# Altium schematic sheet PCB_Schematic.SchDoc: PCB-Schematik
size A4; Date: 22.11.2025; Author: Alexander Schiechtl; Revision: v1.0; SheetNumber: 1; SheetTotal: 1; Project: 3D_Scanner; SPICEModelCacheZUWSFTOK: <root> / <DocumentId>ZUWSFTOK</DocumentId> / </root>
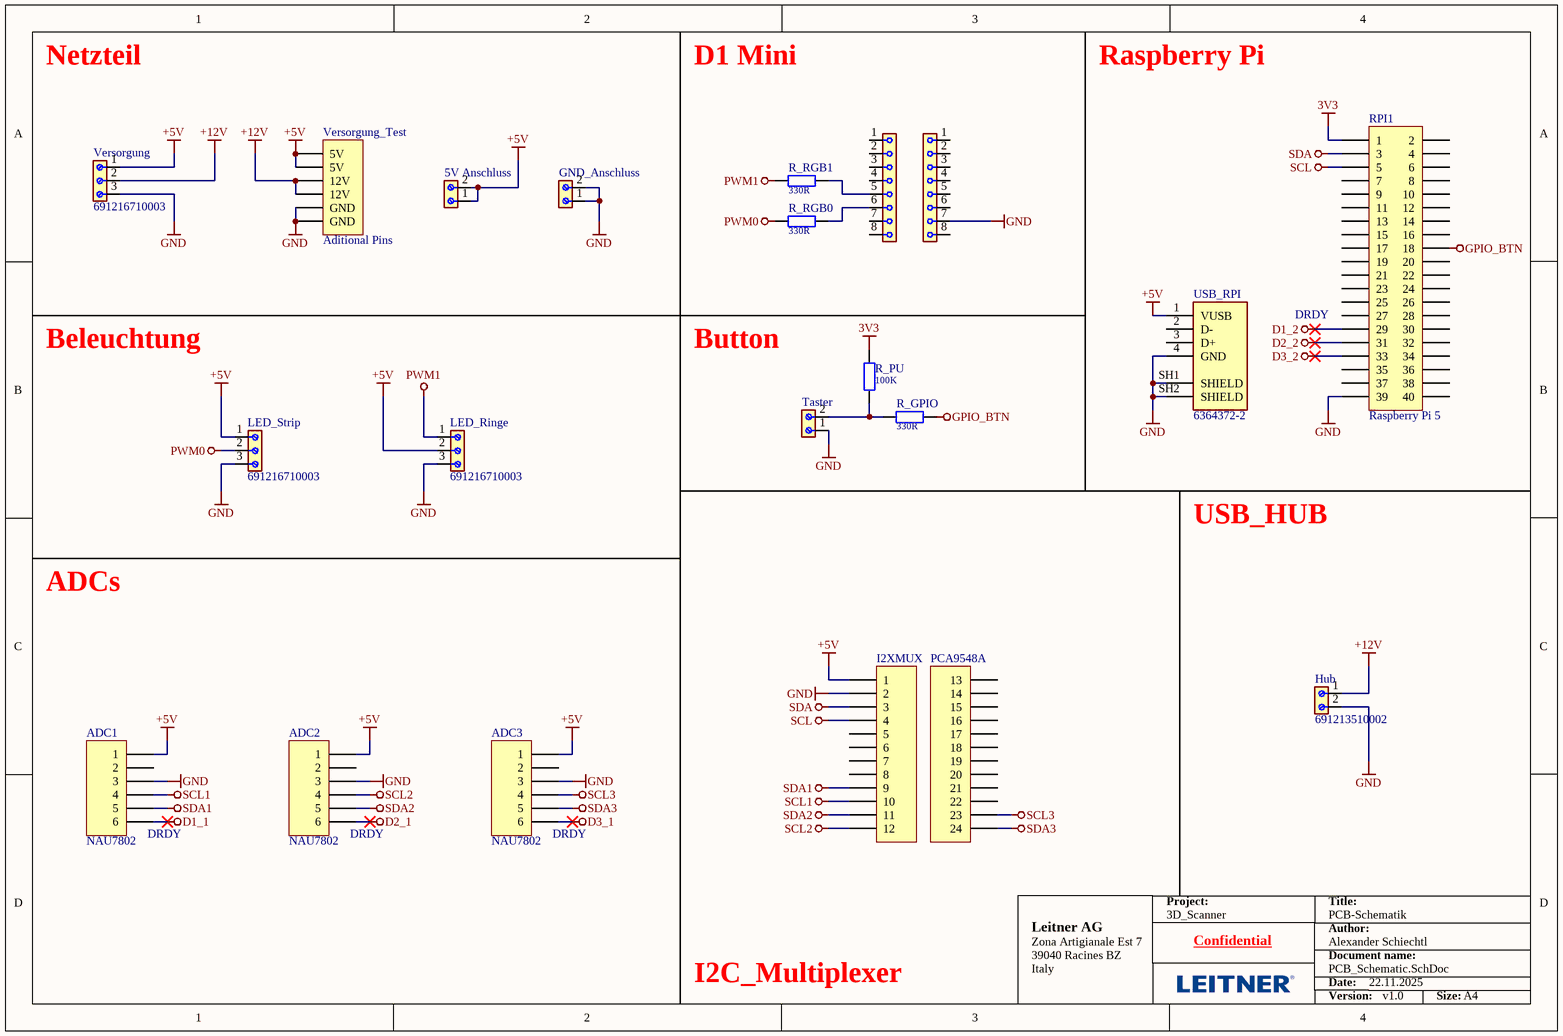
[diagram p0: PCB_Schematic.SchDoc]

## Parts
5V_Anschluss  691213510002  [691213510002]  (value not drawn)
ADC1  NAU7802  [HDR1X6]
ADC2  NAU7802  [HDR1X6]
ADC3  NAU7802  [HDR1X6]
ESP1  6130XX11821_61300811821  [61300811821]  (value not drawn)
ESP2  6130XX11821_61300811821  [61300811821]  (value not drawn)
GND_Anschluss  691213510002  [691213510002]  (value not drawn)
Hub  691213510002  [691213510002]
I2XMUX  Header 12  [HDR1X12]  (value not drawn)
LED_Ringe  691216710003  [691216710003]
LED_Strip  691216710003  [691216710003]
PCA9548A  Header 12  [HDR1X12]  (value not drawn)
R_GPIO  330R  [R_0207/RM4]
R_PU  100K  [R_0207/RM4]
R_RGB0  330R  [R_0207/RM4]
R_RGB1  330R  [R_0207/RM4]
RPI1  Raspberry Pi 5  [HDR2X20]
Taster  691213510002  [691213510002]  (value not drawn)
USB_RPI  6364372-2  [TE_6364372-2]
Versorgung  691216710003  [691216710003]
Versorgung_Test  Aditional Pins  [HDR1X6]

## Nets
3V3: R_PU.1 RPI1.1
+5V: 5V_Anschluss.1 5V_Anschluss.2 ADC1.1 ADC2.1 ADC3.1 I2XMUX.1 LED_Ringe.2 LED_Strip.1 USB_RPI.1(VUSB) Versorgung.1 Versorgung_Test.5(5V) Versorgung_Test.6(5V)
+12V: Hub.1 Versorgung.2 Versorgung_Test.3(12V) Versorgung_Test.4(12V)
D1_1: ADC1.6
D1_2: RPI1.29
D2_1: ADC2.6
D2_2: RPI1.31
D3_1: ADC3.6
D3_2: RPI1.33
GND: ADC1.3 ADC2.3 ADC3.3 ESP2.7 GND_Anschluss.1 GND_Anschluss.2 Hub.2 I2XMUX.2 LED_Ringe.3 LED_Strip.3 RPI1.39 Taster.1 USB_RPI.4(GND) USB_RPI.SH1(SHIELD) USB_RPI.SH2(SHIELD) Versorgung.3 Versorgung_Test.1(GND) Versorgung_Test.2(GND)
GPIO_BTN: R_GPIO.1 RPI1.18
PWM0: LED_Strip.2 R_RGB0.2
PWM1: LED_Ringe.1 R_RGB1.2
SCL: I2XMUX.4 RPI1.5
SCL1: ADC1.4 I2XMUX.10
SCL2: ADC2.4 I2XMUX.12
SCL3: ADC3.4 PCA9548A.11(23)
SDA: I2XMUX.3 RPI1.3
SDA1: ADC1.5 I2XMUX.9
SDA2: ADC2.5 I2XMUX.11
SDA3: ADC3.5 PCA9548A.12(24)
NetESP1_5: ESP1.5 R_RGB1.1
NetESP1_6: ESP1.6 R_RGB0.1
NetR_GPIO_2: R_GPIO.2 R_PU.2 Taster.2

Not connected (* = marked no-connect by the designer): ADC1 2; ADC2 2; ADC3 2; ESP1 1 2 3 4 7 8; ESP2 1 2 3 4 5 6 8; I2XMUX 5 6 7 8; PCA9548A 1(13) 2(14) 3(15) 4(16) 5(17) 6(18) 7(19) 8(20) 9(21) 10(22); RPI1 2 4 6 7 8 9 10 11 12 13 14 15 16 17 19 20 21 22 23 24 25 26 27 28 30 32 34 35 36 37 38 40; USB_RPI 2(D-) 3(D+)

## Notes on the sheet
- Netzteil
- D1 Mini
- Raspberry Pi
- Beleuchtung
- Button
- (near RPI1) DRDY
- USB_HUB
- ADCs
- (near ADC1) DRDY
- (near ADC2) DRDY
- (near ADC3) DRDY
- I2C_Multiplexer
- Project:
- Title:
- Leitner AG
- Zona Artigianale Est 7
- 39040 Racines BZ
- Italy
- Confidential
- Author:
- Document name:
- Date:
- Version:
- Size:
- A4

## Library data of the parts
5V_Anschluss GND_Anschluss Hub Taster = 691213510002: 2 Position Wire to Board Terminal Block Horizontal with Board 0.200 (5.08mm) Through Hole; MF: WÃ¼rth Elektronik; SnapEDA_Link: https://www.snapeda.com/parts/691213510002/W%25C3%25BCrth+Elektronik+Midcom/view-part/?ref=snap; Package: None; Value: *; MP: 691213510002; Check_prices: https://www.snapeda.com/parts/691213510002/W%25C3%25BCrth+Elektronik+Midcom/view-part/?ref=eda
ADC1-ADC3 Versorgung_Test = Header 6: Header, 6-Pin; LatestRevisionDate: 17-Jul-2002; LatestRevisionNote: Re-released for DXP Platform.; Publisher: Altium Limited
ESP1 ESP2 = 6130XX11821_61300811821: Female header Temperature range: -40 ... +125 Â°C Colour: Black Connector Design: Single Row / Straight / Without Shroud Connector Termination: THT Contact material: Gold-Plated Copper Gender of contacts: Female Housing Material: Polybutylene Terephthalat; MF: WÃ¼rth Elektronik; SnapEDA_Link: https://www.snapeda.com/parts/61300811821/W%25C3%25BCrth+Elektronik+Midcom/view-part/?ref=snap; Package: None; Value: *; MP: 61300811821; Check_prices: https://www.snapeda.com/parts/61300811821/W%25C3%25BCrth+Elektronik+Midcom/view-part/?ref=eda
I2XMUX PCA9548A = Header 12: Header, 12-Pin; LatestRevisionDate: 17-Jul-2002; LatestRevisionNote: Re-released for DXP Platform.; Publisher: Altium Limited
LED_Ringe LED_Strip Versorgung = 691216710003: 5.00 MM TERMINAL BLOCK;; MF: WÃ¼rth Elektronik; SnapEDA_Link: https://www.snapeda.com/parts/691216710003/W%25C3%25BCrth+Elektronik+Midcom/view-part/?ref=snap; Package: None; Value: *; MP: 691216710003; Check_prices: https://www.snapeda.com/parts/691216710003/W%25C3%25BCrth+Elektronik+Midcom/view-part/?ref=eda
R_GPIO R_PU R_RGB0 R_RGB1 = R: Resistor; Usage: only permitted for non-commercial purposes at HTL I Innsbruck; Published: 21-Feb-2011; LatestRevisionDate: 07-Sep-2019
  R_GPIO R_RGB0 R_RGB1: Value: 330R
  R_PU: Value: 100K
RPI1 = Header 20X2: Header, 20-Pin, Dual row; LatestRevisionDate: 17-Jul-2002; LatestRevisionNote: Re-released for DXP Platform.; Publisher: Altium Limited
USB_RPI = 6364372-2: Conn USB 2.0 Type A RCP 4 POS Solder RA Thru-Hole 4 Terminal 1 Port Box/Tube; MF: TE Connectivity; SnapEDA_Link: https://www.snapeda.com/parts/6364372-2/TE+Connectivity+AMP+Connectors/view-part/?ref=snap; Package: None; MP: 6364372-2; Check_prices: https://www.snapeda.com/parts/6364372-2/TE+Connectivity+AMP+Connectors/view-part/?ref=eda; Purchase-URL: https://pricing.snapeda.com/search/part/6364372-2/?ref=eda; Digi-Key_Part_Number: A122647-ND; EU_RoHS_Compliance: Compliant; Value: *